# Altium schematic sheet MCU.SchDoc
size Letter
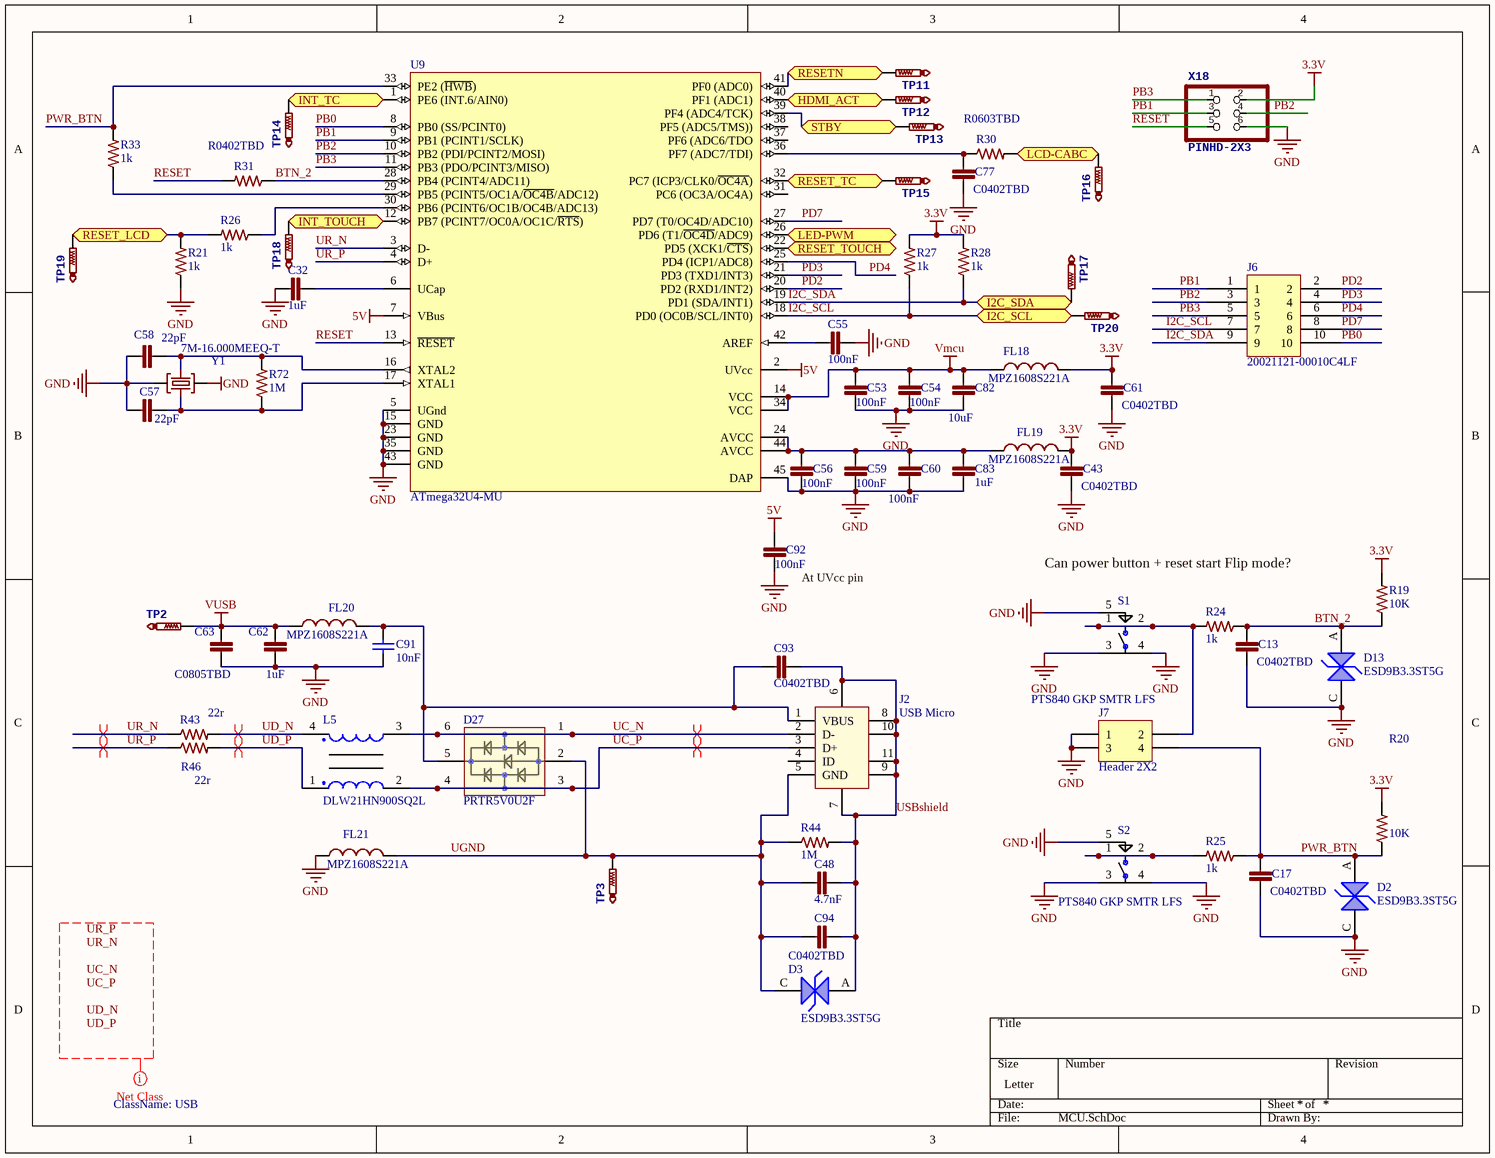
[diagram p0: MCU.SchDoc]

## Parts
C13  C0402TBD  [C0402]
C17  C0402TBD  [C0402]
C32  1uF  [C0402]
C43  C0402TBD  [C0402]
C48  4.7nF  [C0402]
C53  100nF  [C0402]
C54  100nF  [C0402]
C55  100nF  [C0402]
C56  100nF  [C0402]
C57  22pF  [C0402]
C58  22pF  [C0402]
C59  100nF  [C0402]
C60  100nF  [C0402]
C61  C0402TBD  [C0402]
C62  1uF  [C0603]
C63  C0805TBD  [C0805]
C77  C0402TBD  [C0402]
C82  10uF  [C0805]
C83  1uF  [C0402]
C91  10nF  [C0402]
C92  100nF  [C0402]
C93  C0402TBD  [C0402]
C94  C0402TBD  [C0402]
D2  ESD9B3.3ST5G  [SOD923-100X40-2N]
D3  ESD9B3.3ST5G  [SOD923-100X40-2N]
D13  ESD9B3.3ST5G  [SOD923-100X40-2N]
D27  PRTR5V0U2F  [SOT886]
FL18  MPZ1608S221A  [C0603]
FL19  MPZ1608S221A  [C0603]
FL20  MPZ1608S221A  [C0603]
FL21  MPZ1608S221A  [C0603]
J2  USB Micro  [10118194-0001LF]
J6  20021121-00010C4LF  [FTSH-105-XX-X-DV]
J7  Header 2X2  [HDR2X2]
L5  DLW21HN900SQ2L  [DLW21HN900SQ2L]
R19  10K  [R0402]
R20  10K  [R0402]
R21  1k  [R0402]
R24  1k  [R0402]
R25  1k  [R0402]
R26  1k  [R0402]
R27  1k  [R0402]
R28  1k  [R0402]
R30  R0603TBD  [R0603]
R31  R0402TBD  [R0402]
R33  1k  [R0402]
R43  22r  [R0402]
R44  1M  [R0402]
R46  22r  [R0402]
R72  1M  [R0402]
S1  PTS840 GKP SMTR LFS  [PTS840 GKP SMTR LFS]
S2  PTS840 GKP SMTR LFS  [PTS840 GKP SMTR LFS]
TP2  TestPoint  [TP1-27]  (value not drawn)  (no BOM)
TP3  TestPoint  [TP1-27]  (value not drawn)  (no BOM)
TP11  TestPoint  [TP1-27]  (value not drawn)  (no BOM)
TP12  TestPoint  [TP1-27]  (value not drawn)  (no BOM)
TP13  TestPoint  [TP1-27]  (value not drawn)  (no BOM)
TP14  TestPoint  [TP1-27]  (value not drawn)  (no BOM)
TP15  TestPoint  [TP1-27]  (value not drawn)  (no BOM)
TP16  TestPoint  [TP1-27]  (value not drawn)  (no BOM)
TP17  TestPoint  [TP1-27]  (value not drawn)  (no BOM)
TP18  TestPoint  [TP1-27]  (value not drawn)  (no BOM)
TP19  TestPoint  [TP1-27]  (value not drawn)  (no BOM)
TP20  TestPoint  [TP1-27]  (value not drawn)  (no BOM)
U9  ATmega32U4-MU  [44PW_L]
X18  PINHD-2X3  [2X03]
Y1  7M-16.000MEEQ-T  [CRYS320250]

## Ports
HDMI_ACT, I2C_SCL, I2C_SDA, INT_TC, INT_TOUCH, LCD-CABC, LED-PWM, RESET_LCD, RESET_TC, RESET_TOUCH, RESETN, STBY

## Nets
3.3V: C43.1 C61.2 FL18.2 FL19.2 R19.2 R20.2 R27.2 R28.2 X18.2
5V: C92.1 U9.2(UVcc) U9.7(VBus)
GND: C13.2 C17.2 C32.2 C43.2 C53.2 C54.2 C55.2 C56.2 C57.2 C58.2 C59.2 C60.2 C61.1 C62.2 C63.2 C77.2 C82.2 C83.2 C91.2 C92.2 D2.C D13.C FL21.1 J7.1 J7.3 R21.1 S1.3 S1.4 S1.5 S2.3 S2.4 S2.5 U9.5(UGnd) U9.15(GND) U9.23(GND) U9.35(GND) U9.43(GND) U9.45(DAP) X18.6 Y1.2(GND) Y1.4(GND)
Vmcu: C53.1 C54.1 C82.1 FL18.1 U9.14(VCC) U9.34(VCC)
VUSB: C62.1 C63.1 FL20.1 TP2.TP
BTN_2: C13.1 D13.A R19.1 R24.1 R31.1 U9.28(PB4_(PCINT4/ADC11))
HDMI_ACT: TP12.TP U9.40(PF1_(ADC1)) ; port HDMI_ACT
I2C_SCL: J6.7 R27.1 TP20.TP U9.18(PD0_(OC0B/SCL/INT0)) ; port I2C_SCL
I2C_SDA: J6.9 R28.1 TP17.TP U9.19(PD1_(SDA/INT1)) ; port I2C_SDA
INT_TC: TP14.TP U9.1(PE6_(INT.6/AIN0)) ; port INT_TC
INT_TOUCH: TP18.TP U9.12(PB7_(PCINT7/OC0A/OC1C/~{RTS})) ; port INT_TOUCH
LCD-CABC: R30.2 TP16.TP ; port LCD-CABC
LED-PWM: U9.26(PD6_(T1/~{OC4D}/ADC9)) ; port LED-PWM
PB0: J6.10 U9.8(PB0_(SS/PCINT0))
PB1: J6.1 U9.9(PB1_(PCINT1/SCLK)) X18.3
PB2: J6.3 U9.10(PB2_(PDI/PCINT2/MOSI)) X18.4
PB3: J6.5 U9.11(PB3_(PDO/PCINT3/MISO)) X18.1
PD2: J6.2 U9.20(PD2_(RXD1/INT2))
PD3: J6.4 U9.21(PD3_(TXD1/INT3))
PD4: J6.6 U9.25(PD4_(ICP1/ADC8))
PD7: J6.8 U9.27(PD7_(T0/OC4D/ADC10))
PWR_BTN: C17.1 D2.A J7.4 R20.1 R25.1 R33.2 U9.33(PE2_(~{HWB}))
RESET: R31.2 U9.13(~{RESET}) X18.5
RESET_LCD: R21.2 R26.2 TP19.TP ; port RESET_LCD
RESET_TC: TP15.TP U9.32(PC7_(ICP3/CLK0/~{OC4A})) ; port RESET_TC
RESET_TOUCH: U9.22(PD5_(XCK1/~{CTS})) ; port RESET_TOUCH
RESETN: TP11.TP U9.41(PF0_(ADC0)) ; port RESETN
STBY: TP13.TP U9.39(PF4_(ADC4/TCK)) ; port STBY
UC_N: D27.1 D27.6 J2.2(D-) L5.3
UC_P: D27.3 D27.4 J2.3(D+) L5.2
UD_N: L5.4 R43.2
UD_P: L5.1 R46.2
UGND: C48.2 C94.2 D3.C D27.2 FL21.2 J2.5(GND) R44.1 TP3.TP
UR_N: R43.1 U9.3(D-)
UR_P: R46.1 U9.4(D+)
USBshield: C48.1 C93.1 C94.1 D3.A J2.6 J2.7 J2.8 J2.9 J2.10 J2.11 R44.2
NetC32_1: C32.1 U9.6(UCap)
NetC55_1: C55.1 U9.42(AREF)
NetC56_1: C56.1 C59.1 C60.1 C83.1 FL19.1 U9.24(AVCC) U9.44(AVCC)
NetC57_1: C57.1 R72.1 U9.17(XTAL1) Y1.1(C1)
NetC58_1: C58.1 R72.2 U9.16(XTAL2) Y1.3(C2)
NetC77_1: C77.1 R30.1 U9.36(PF7_(ADC7/TDI))
NetC91_1: C91.1 C93.2 D27.5 FL20.2 J2.1(VBUS)
NetJ7_2: J7.2 R24.2 S1.1 S1.2
NetR25_2: R25.2 S2.1 S2.2
NetR26_1: R26.1 U9.30(PB6_(PCINT6/OC1B/OC4B/ADC13))
NetR33_1: R33.1 U9.29(PB5_(PCINT5/OC1A/~{OC4B}/ADC12))

Not connected (* = marked no-connect by the designer): J2 4(ID); U9 31(PC6_(OC3A/OC4A)) 37(PF6_(ADC6/TDO) 38(PF5_(ADC5/TMS)))

## Layout directives
differential pair: UC_N, UC_P, UD_N, UD_P, UR_N, UR_P
net class USB: UC_N, UC_P, UD_N, UD_P, UR_N, UR_P

## Notes on the sheet
- Can power button + reset start Flip mode?
- (near C92) At UVcc pin
- Labels drawn without touching a wire or pin: UC_N, UC_P, UD_N, UD_P, UR_N, UR_P

## Library data of the parts
C13 C17 C43 C61 C77 C93 C94 = C0402TBD: Capacitor Non Polarized; LastRevisionNote: ImportComponents; Published: 23-Apr-2014; Publisher: UltiMachine; VALUE: C0402TBD; LastRevisionDate: 23-Apr-2014
C32 C83 = GRM155R60J105KE19D: CAP CER 0402 1uF 6.3V 10% X5R; LastRevisionNote: ImportComponents; Published: 23-Apr-2014; Publisher: UltiMachine; LastRevisionDate: 23-Apr-2014; ManufacturerPartNumber: GRM155R60J105KE19D; VALUE: 1uF
C48 = CC0402KRX7R8BB472: CAP CER 0402 4.7nF 25V 10% X7R; LastRevisionNote: ImportComponents; Published: 23-Apr-2014; Publisher: UltiMachine; VALUE: 4.7nF; LastRevisionDate: 23-Apr-2014; ManufacturerPartNumber: CC0402KRX7R8BB472
C53-C56 C59 C60 C92 = GRM155R71C104KA88D: CAP CER 0402 100nF 16V 10% X7R; LastRevisionNote: ImportComponents; Published: 23-Apr-2014; Publisher: UltiMachine; LastRevisionDate: 23-Apr-2014; ManufacturerPartNumber: GRM155R71C104KA88D; VALUE: 100nF
C57 C58 = 04025A220JAT2A: CAP CER 0402 22pF 50V 5% C0G; LastRevisionNote: ImportComponents; Published: 23-Apr-2014; Publisher: UltiMachine; LastRevisionDate: 23-Apr-2014; ManufacturerPartNumber: 04025A220JAT2A; VALUE: 22pF
C62 = CC0603ZRY5V6BB105: CAP CER 0603 1uF 10V Y5V; LastRevisionNote: ImportComponents; Published: 23-Apr-2014; Publisher: UltiMachine; LastRevisionDate: 23-Apr-2014; ManufacturerPartNumber: CC0603ZRY5V6BB105; VALUE: 1uF
C63 = C0805TBD: Capacitor Non Polarized; LastRevisionNote: ImportComponents; Published: 23-Apr-2014; Publisher: UltiMachine; LastRevisionDate: 23-Apr-2014; VALUE: C0805TBD
C82 = C0805C106K8PACTU: CAP CER 0805 10uF 10V 10% X5R; LastRevisionNote: ImportComponents; Published: 23-Apr-2014; Publisher: UltiMachine; LastRevisionDate: 23-Apr-2014; ManufacturerPartNumber: C0805C106K8PACTU; VALUE: 10uF
C91 = GRM155R71H103JA88D: CAP CER 10nF 50V X7R 0402; MFR: Murata; Part Description: CAP CER 10000PF 50V X7R 0402; Value: 0.01uF 50V; Tolerance: 10%; Voltage: 6.3VDC; Published: 10 - Dec - 2014; Publisher: Ultimachine; LatestRevisionDate: 10 - Dec - 2014; LatestRevisionNote: Ultimachine Footprint Added; Component Type: Chip Capacitor; MFR Part #: GRM155R71H103JA88D; Mounting Type: SMT 0402; Datasheet: http://search.murata.co.jp/Ceramy/image/img/A01X/G101/ENG/GRM155R71H103JA88-01.pdf; Height: 0.5 ±0.05mm; Digikey #: 490-7763-1-ND; PackageReference: 0402
D2 D3 D13 = ESD9B3.3ST5G: 11.5 V 15 pF SMT Transient Voltage Suppressor - SOD-923
D27 = PRTR5V0U2F: Rail-to-rail ESD protection devices
FL18-FL21 = MPZ1608S221A: Ferrite; LastRevisionNote: ImportComponents; Published: 23-Apr-2014; Publisher: UltiMachine; LastRevisionDate: 23-Apr-2014; Value: MPZ1608S221A
J2 = 10118194-0001LF: Conn Recept USB - micro B 2.0 5 Pos SMT, Rt Angle, Horizontal
J6 = ARM Cortex JTAG-DEBUG Header
J7 = Header 2X2: Header, 2-Pin, Dual row; LatestRevisionDate: 17-Jul-2002; LatestRevisionNote: Re-released for DXP Platform.; Publisher: Altium Limited
L5 = DLW21HN900SQ2L: Common Mode Chokes Dual 90Ohm 100MHz 330mA 350mOhm DCR SMD
R19 R20 = RC0402FR-0710KP: RES SMD 10K OHM 1% 1/16W 0402; LastRevisionNote: ImportComponents; Published: 23-Apr-2014; Publisher: UltiMachine; LastRevisionDate: 23-Apr-2014; ManufacturerPartNumber: RC0402FR-0710KP; VALUE: 10K
R21 R24-R28 R33 = RK73H1ETTP1001F: RES 0402 1k 63mW 1%; LastRevisionNote: ImportComponents; Published: 23-Apr-2014; Publisher: UltiMachine; LastRevisionDate: 23-Apr-2014; VALUE: 1k
R30 = R0603TBD: Resistor; LastRevisionNote: ImportComponents; Published: 23-Apr-2014; Publisher: UltiMachine; LastRevisionDate: 23-Apr-2014; VALUE: R0603TBD
R31 = R0402TBD: Resistor; LastRevisionNote: ImportComponents; Published: 23-Apr-2014; Publisher: UltiMachine; LastRevisionDate: 23-Apr-2014; VALUE: R0402TBD
R43 R46 = RC0402FR-0722RL: RES 0402 22r 63mW 1%; LastRevisionNote: ImportComponents; Published: 23-Apr-2014; Publisher: UltiMachine; LastRevisionDate: 23-Apr-2014; VALUE: 22r
R44 R72 = ERJ2GEJ105X: RES 0402 1M 100mW 5%; LastRevisionNote: ImportComponents; Published: 23-Apr-2014; Publisher: UltiMachine; LastRevisionDate: 23-Apr-2014; ManufacturerPartNumber: ERJ2GEJ105X; VALUE: 1M
S1 S2 = PTS840 GKP SMTR LFS: SWITCH TACTILE SPST-NO 0.05A 12V
TP2 TP3 TP11-TP20 = TestPoint: Test Point; LastRevisionNote: ImportComponents; Published: 23-Apr-2014; Publisher: UltiMachine; LastRevisionDate: 23-Apr-2014
U9 = MC-8B-ATM16U4-SQ45
X18 = PINHD-2X3: PIN HEADER; LastRevisionNote: ImportComponents; LastRevisionDate: 23-Apr-2014; Published: 23-Apr-2014; Publisher: UltiMachine
Y1 = 7M-16.000MEEQ-T: Crystal 16mHz 10ppm 10pF; LastRevisionNote: ImportComponents; LastRevisionDate: 23-Apr-2014; ManufacturerPartNumber: 7M-16.000MEEQ-T; Published: 23-Apr-2014; Publisher: UltiMachine